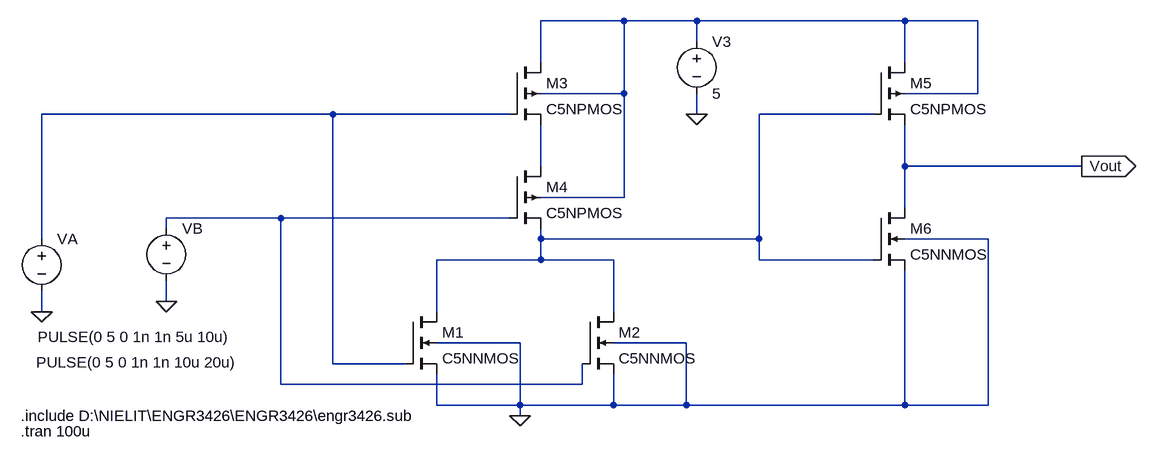
[diagram p0: schematic OR.asc]
OR.asc, the LTspice schematic file:
Version 4
SHEET 1 1232 680
WIRE 416 -160 288 -160
WIRE 528 -160 416 -160
WIRE 848 -160 528 -160
WIRE 960 -160 848 -160
WIRE 528 -128 528 -160
WIRE 288 -96 288 -160
WIRE 848 -96 848 -160
WIRE 416 -48 416 -160
WIRE 416 -48 288 -48
WIRE 960 -48 960 -160
WIRE 960 -48 848 -48
WIRE -32 -16 -480 -16
WIRE 240 -16 -32 -16
WIRE 528 -16 528 -48
WIRE 800 -16 624 -16
WIRE 288 64 288 0
WIRE 848 64 848 0
WIRE 1120 64 848 64
WIRE 416 112 416 -48
WIRE 416 112 288 112
WIRE 848 128 848 64
WIRE -112 144 -288 144
WIRE 240 144 -112 144
WIRE -288 160 -288 144
WIRE -480 176 -480 -16
WIRE 288 176 288 160
WIRE 624 176 624 -16
WIRE 624 176 288 176
WIRE 976 176 848 176
WIRE 288 208 288 176
WIRE 288 208 128 208
WIRE 400 208 288 208
WIRE 624 208 624 176
WIRE 800 208 624 208
WIRE -288 272 -288 240
WIRE -480 288 -480 256
WIRE 128 288 128 208
WIRE 400 288 400 208
WIRE 256 336 128 336
WIRE 512 336 400 336
WIRE -32 368 -32 -16
WIRE 80 368 -32 368
WIRE -112 400 -112 144
WIRE 352 400 352 368
WIRE 352 400 -112 400
WIRE 128 432 128 384
WIRE 256 432 256 336
WIRE 256 432 128 432
WIRE 400 432 400 384
WIRE 400 432 256 432
WIRE 512 432 512 336
WIRE 512 432 400 432
WIRE 848 432 848 224
WIRE 848 432 512 432
WIRE 976 432 976 176
WIRE 976 432 848 432
WIRE 256 448 256 432
FLAG -480 288 0
FLAG -288 272 0
FLAG 528 -16 0
FLAG 256 448 0
FLAG 1120 64 Vout
IOPIN 1120 64 Out
SYMBOL nmos4 80 288 R0
SYMATTR InstName M1
SYMATTR Value C5NNMOS
SYMATTR Value2 l=0.6u w=3.6u
SYMBOL nmos4 352 288 R0
SYMATTR InstName M2
SYMATTR Value C5NNMOS
SYMATTR Value2 l=0.6u w=3.6u
SYMBOL pmos4 240 -96 R0
SYMATTR InstName M3
SYMATTR Value C5NPMOS
SYMATTR Value2 l=0.6u w=7.2u
SYMBOL pmos4 240 64 R0
SYMATTR InstName M4
SYMATTR Value C5NPMOS
SYMATTR Value2 l=0.6u w=7.2u
SYMBOL voltage -480 160 R0
WINDOW 3 -6 167 Left 2
WINDOW 123 0 0 Left 0
WINDOW 39 0 0 Left 0
SYMATTR InstName VA
SYMATTR Value PULSE(0 5 0 1n 1n 5u 10u)
SYMBOL voltage -288 144 R0
WINDOW 3 -200 222 Left 2
WINDOW 123 0 0 Left 0
WINDOW 39 0 0 Left 0
SYMATTR InstName VB
SYMATTR Value PULSE(0 5 0 1n 1n 10u 20u)
SYMBOL voltage 528 -144 R0
SYMATTR InstName V3
SYMATTR Value 5
SYMBOL pmos4 800 -96 R0
SYMATTR InstName M5
SYMATTR Value C5NPMOS
SYMATTR Value2 l=0.6u w=7.2u
SYMBOL nmos4 800 128 R0
SYMATTR InstName M6
SYMATTR Value C5NNMOS
SYMATTR Value2 l=0.6u w=3.6u
TEXT -512 448 Left 2 !.include D:\\NIELIT\\ENGR3426\\ENGR3426\\engr3426.sub
TEXT -512 472 Left 2 !.tran 100u

The netlist it stands for:
* OR.asc
M1 N003 N002 0 0 C5NNMOS l=0.6u w=3.6u
M2 N003 N005 0 0 C5NNMOS l=0.6u w=3.6u
M3 N001 N002 N004 N001 C5NPMOS l=0.6u w=7.2u
M4 N004 N005 N003 N001 C5NPMOS l=0.6u w=7.2u
VA N002 0 PULSE(0 5 0 1n 1n 5u 10u)
VB N005 0 PULSE(0 5 0 1n 1n 10u 20u)
V3 N001 0 5
M5 N001 N003 Vout N001 C5NPMOS l=0.6u w=7.2u
M6 Vout N003 0 0 C5NNMOS l=0.6u w=3.6u
.model NMOS NMOS
.model PMOS PMOS
.lib standard.mos
.include D:\NIELIT\ENGR3426\ENGR3426\engr3426.sub
.tran 100u
.backanno
.end